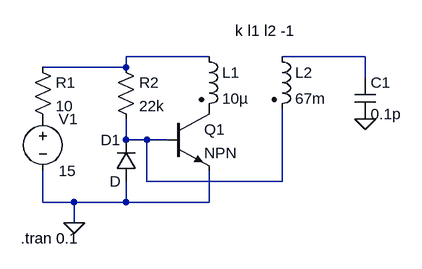
[diagram p0: schematic Draft2.asc]
Draft2.asc, the LTspice schematic file:
Version 4
SHEET 1 880 680
WIRE 128 32 0 32
WIRE 368 32 240 32
WIRE 0 48 0 32
WIRE 0 48 -128 48
WIRE 368 64 368 32
WIRE 0 160 0 128
WIRE 32 160 0 160
WIRE 64 160 32 160
WIRE 32 224 32 160
WIRE 240 224 240 112
WIRE 240 224 32 224
WIRE -128 256 -128 208
WIRE -80 256 -128 256
WIRE 0 256 0 224
WIRE 0 256 -80 256
WIRE 128 256 128 208
WIRE 128 256 0 256
WIRE -80 288 -80 256
FLAG -80 288 0
FLAG 368 128 0
SYMBOL voltage -128 112 R0
WINDOW 123 0 0 Left 0
WINDOW 39 0 0 Left 0
SYMATTR InstName V1
SYMATTR Value 15
SYMBOL ind2 112 16 R0
SYMATTR InstName L1
SYMATTR Value 10µ
SYMATTR Type ind
SYMBOL ind2 224 16 R0
SYMATTR InstName L2
SYMATTR Value 67m
SYMATTR Type ind
SYMBOL res -144 32 R0
SYMATTR InstName R1
SYMATTR Value 10
SYMBOL res -16 32 R0
SYMATTR InstName R2
SYMATTR Value 22k
SYMBOL npn 64 112 R0
SYMATTR InstName Q1
SYMBOL diode 16 224 R180
WINDOW 0 24 64 Left 2
WINDOW 3 24 0 Left 2
SYMATTR InstName D1
SYMBOL cap 352 64 R0
SYMATTR InstName C1
SYMATTR Value 0.1p
TEXT 168 -8 Left 2 !k l1 l2 -1
TEXT -162 312 Left 2 !.tran 0.1

The netlist it stands for:
* Draft2.asc
V1 P001 0 15
L1 N001 P002 10µ
L2 N002 N003 67m
R1 N001 P001 10
R2 N001 N003 22k
Q1 P002 N003 0 0 NPN
D1 0 N003 D
C1 N002 0 0.1p
.model D D
.lib standard.dio
.model NPN NPN
.model PNP PNP
.lib standard.bjt
k l1 l2 -1
.tran 0.1
.backanno
.end